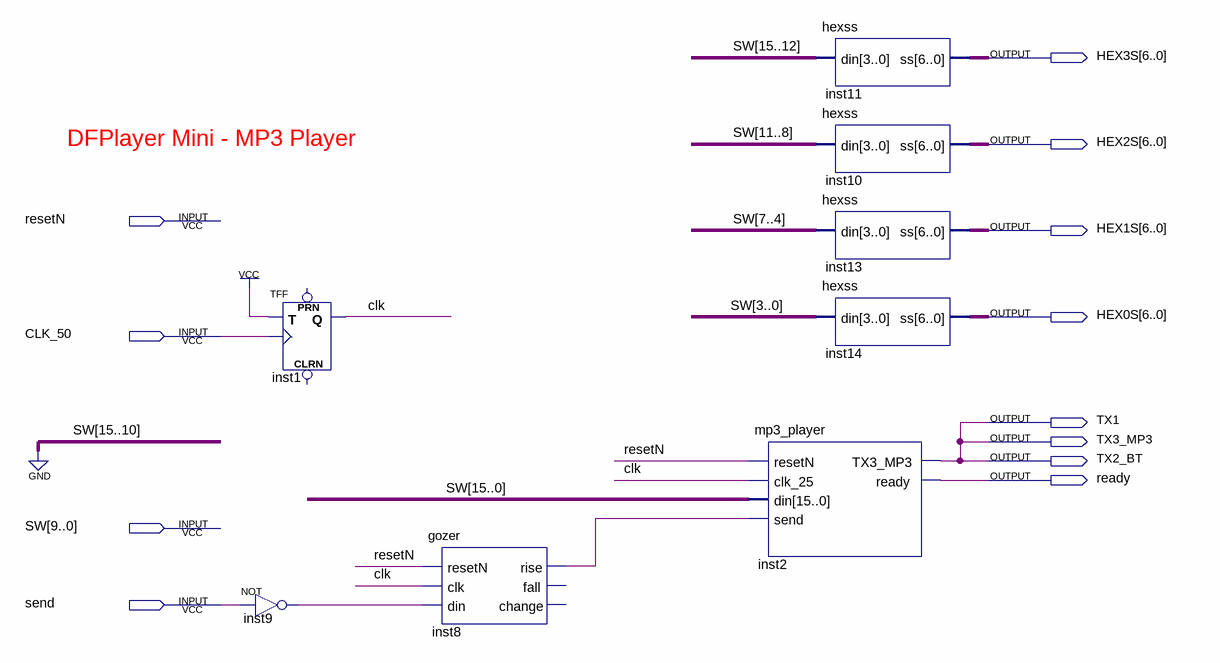
[diagram p0: schematic sheet]
// Quartus schematic test_united_mp3_player.bdf as structural Verilog: 8 symbols, 12 pins
module test_united_mp3_player (
  input  resetN,
  input  CLK_50,
  input  [9:0] SW,
  input  send,
  output [6:0] HEX3S,
  output [6:0] HEX2S,
  output [6:0] HEX1S,
  output [6:0] HEX0S,
  output TX1,
  output TX3_MP3,
  output TX2_BT,
  output ready
);

  wire clk, inst8_rise, inst9_out;

  not inst9 (inst9_out, send);
  TFF inst1 (.T(1'b1), .CLK(CLK_50), .Q(clk));  // open: PRN, CLRN
  gozer inst8 (.resetN(resetN), .clk(clk), .din(inst9_out), .rise(inst8_rise));  // open: fall, change
  mp3_player inst2 (
    .resetN(resetN), .clk_25(clk), .din({{6{1'b0}}, SW}), .send(inst8_rise), .TX3_MP3(TX1), .ready(ready));
  hexss inst11 (.din(4'b0000), .ss(HEX3S));
  hexss inst10 (.din({2'b00, SW[9:8]}), .ss(HEX2S));
  hexss inst13 (.din(SW[7:4]), .ss(HEX1S));
  hexss inst14 (.din(SW[3:0]), .ss(HEX0S));

  assign TX2_BT = TX1;
  assign TX3_MP3 = TX1;

  // Notes on the sheet:
  //   DFPlayer Mini - MP3 Player
endmodule
